# Altium project Mordovia_MCH_CLK.PrjPCB (part 2 of 2)

## Sheet PWR.SchDoc: Mordovia_MCH_CLK
size A4; Date: 2021; Author: Filip Świtakowski; DrawnBy: Filip Świtakowski; DocumentNumber: 4; Revision: 1.0; SheetNumber: 4; SheetTotal: 4; ModifiedBy: -; CheckedDate: -; Title2: PWR; DivGrp: WUT ISE; Designer: Filip Świtakowski
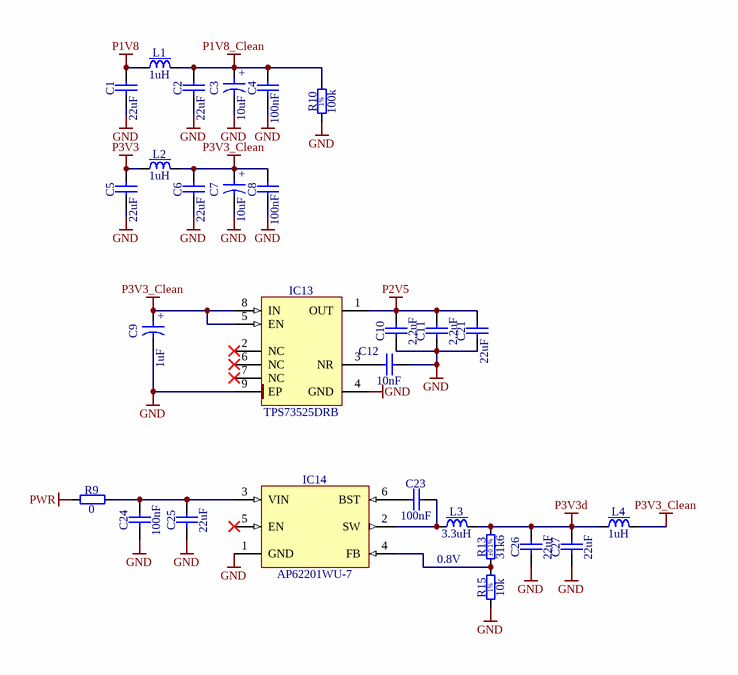
[diagram p4: PWR.SchDoc]

### Parts
C1  22uF  [CAPC2012X135N]
C2  22uF  [CAPC2012X135N]
C3  10uF  [CAPMP3216X180N]
C4  100nF  [CAPC1005X55N]
C5  22uF  [CAPC2012X135N]
C6  22uF  [CAPC2012X135N]
C7  10uF  [CAPMP3216X180N]
C8  100nF  [CAPC1005X55N]
C9  1uF  [CAPMP3216X180N]
C10  2.2uF  [CAPC1608X87N]
C11  2.2uF  [CAPC1608X87N]
C12  10nF  [CAPC1005X55N]
C21  22uF  [CAPC2012X135N]
C23  100nF  [CAPC1005X55N]
C24  100nF  [CAPC1005X55N]
C25  22uF  [CAPC2012X135N]
C26  22uF  [CAPC2012X135N]
C27  22uF  [CAPC2012X135N]
IC13  TPS73525DRB  [TEXAS_DRB(S-PVSON-N8)]
IC14  AP62201WU-7  [SOT95P280X100-6N]
L1  1uH  [IND_PANASONIC_ELLVGG]
L2  1uH  [IND_PANASONIC_ELLVGG]
L3  3.3uH  [IND_WURTH_WE-TPC_4828]
L4  1uH  [IND_PANASONIC_ELLVGG]
R9  0  [RESC1608X55N]
R10  100k  [RESC1005X40N]
R13  31k6  Tolerance: ±0.1%  [RESC1005X35N]
R15  10k  [RESC1005X40N]

### Nets
GND: C1.1 C2.1 C3.2 C4.1 C5.1 C6.1 C7.2 C8.1 C9.2 C10.1 C11.1 C12.2 C21.1 C24.1 C25.1 C26.1 C27.1 IC13.4(GND) IC13.9(EP) IC14.1(GND) R10.1 R15.1
P1V8: C1.2 L1.1
P1V8_Clean: C2.2 C3.1 C4.2 L1.2 R10.2
P2V5: C10.2 C11.2 C21.2 IC13.1(OUT)
P3V3: C5.2 L2.1
P3V3_Clean: C6.2 C7.1 C8.2 C9.1 IC13.5(EN) IC13.8(IN) L2.2 L4.2
P3V3d: C26.2 C27.2 L3.2 L4.1 R13.2
PWR: R9.1
NetC12_1: C12.1 IC13.3(NR)
NetC23_1: C23.1 IC14.6(BST)
NetC23_2: C23.2 IC14.2(SW) L3.1
NetC24_2: C24.2 C25.2 IC14.3(VIN) R9.2
NetIC14_4: IC14.4(FB) R13.1 R15.2

Not connected (* = marked no-connect by the designer): IC13 2(NC)* 6(NC)* 7(NC)*; IC14 5(EN)*

### Notes on the sheet
- 0.8V
- Project/Equipment
- Document
- Designer
- Drawn by
- Check.by
- 01.20201
- PW ISE
- Contact
- File
- Last Mod.
- Print Date
- Sheet
- Size
- A4
- of
- Rev
- Copyright WUT ISE 2021.
  This documentation describes Open Hardware and is licensed under the CERN OHL v.1.2. You may redistribute and modify this documentation under the terms of the CERN OHL v.1.2. (http://ohwr.org/CERNOHL). This documentation is distributed WITHOUT ANY EXPRESS OR IMPLIED WARRANTY, INCLUDING OF MERCHANTABILITY, SATISFACTORY QUALITY AND FITNESS FOR A PARTICULAR PURPOSE. Please see the CERN OHL v.1.2 for applicable conditions.
- Nowowiejska 15/19 00-665 Warsaw
- (in symbol CTE3216-18_1UF_16V_10%) +
- (in symbol CTE3216-18_10UF_16V_20%_AVX_TCJ) +
- (in symbol R0402_10K_1%_0.0625W_100PPM) 1%
- (in symbol R0402_100K_1%_0.0625W_100PPM) 1%

### Library data of the parts
C1 C2 C5 C6 C21 C25-C27 = CC0805_22UF_16V_10%_X5R: Non-polarised capacitor; Part Description: SMD Multilayer Chip Ceramic Capacitor; Manufacturer: GENERIC; Manufacturer1 Part Number: C2012X5R1C226KT; Voltage: 16V; TC: X5R; Tolerance: ±10%; Part Number: CC0805_22UF_16V_10%_X5R; Component Kind: Standard; Component Type: Standard; Pin Count: 2; Value: 22uF; Status: Preferred; Manufacturer Part Number: CC0805_22UF_16V_10%_X5R; Case: 0805; Mounted: Yes; Socket: No; SMD: Yes; Sense: No; Manufacturer1 Example: TDK; Manufacturer1 ComponentHeight: 1.35mm; HelpURL: \\cern.ch\dfs\Applications\Altium\Datasheets\CC0805_X5R_TDK_C.pdf; Author: CERN DEM JLC; CreateDate: 25.10.2012; LatestRevisionDate: 25.10.2012
C3 C7 = CTE3216-18_10UF_16V_20%_AVX_TCJ: Polarised capacitor; Part Description: ESR 0R200 Tantalum Solid Electrolytic Chip Capacitor with Conductive Polymer Electrode; Manufacturer: AVX; Manufacturer Part Number: TCJA106M016R0200; Voltage: 16V; Tolerance: ±20%; Part Number: CTE3216-18_10UF_16V_20%_AVX_TCJ; Component Kind: Standard; Component Type: Standard; Pin Count: 2; Value: 10uF; Status: Preferred; Case: A; Mounted: Yes; Socket: No; SMD: Yes; Sense: No; ComponentHeight: 1.8mm; HelpURL: \\cern.ch\dfs\Applications\Altium\Datasheets\CTE_AVX_TCJ.pdf; Author: CERN DEM JLC; CreateDate: 29.03.2012; LatestRevisionDate: 29.03.2012
C4 C8 = CC0402_100NF_50V_10%_X7R: Non-polarised capacitor; Part Description: SMD Multilayer Chip Ceramic Capacitor; Manufacturer: GENERIC; Manufacturer1 Part Number: GRM155R71H104KE14D; Voltage: 50V; TC: X7R; Tolerance: ±10%; Part Number: CC0402_100NF_50V_10%_X7R; Component Kind: Standard; Component Type: Standard; Pin Count: 2; Value: 100nF; Status: None; Manufacturer Part Number: CC0402_100NF_50V_10%_X7R; Case: 0402; Mounted: Yes; Socket: No; SMD: Yes; Sense: No; Manufacturer1 Example: MURATA; Manufacturer1 ComponentHeight: 0.55mm; HelpURL: \\cern.ch\dfs\Applications\Altium\Datasheets\CC0402_MURATA_GRM155R71H104KE14D.pdf; Author: CERN DEM MR; CreateDate: 30.06.2017; LatestRevisionDate: 30.06.2017
C9 = CTE3216-18_1UF_16V_10%: Polarised capacitor; Part Description: Solid Tantalum Chip Capacitor; Manufacturer: GENERIC; Manufacturer1 Part Number: TAJA105K016RNJ; Voltage: 16V; Tolerance: ±10%; Part Number: CTE3216-18_1UF_16V_10%; Component Kind: Standard; Component Type: Standard; Pin Count: 2; Value: 1uF; Status: Preferred; Manufacturer Part Number: CTE3216-18_1UF_16V_10%; Case: A; Mounted: Yes; Socket: No; SMD: Yes; Sense: No; Manufacturer1 Example: AVX; Manufacturer1 ComponentHeight: 1.8mm; HelpURL: \\cern.ch\dfs\Applications\Altium\Datasheets\CTE_AVX_TAJ.pdf; Author: CERN DEM JLC; CreateDate: 03.09.2012; LatestRevisionDate: 03.09.2012
C10 C11 = CC0603_2.2UF_16V_10%_X5R: Non-polarised capacitor; Part Description: SMD Multilayer Chip Ceramic Capacitor; Manufacturer: GENERIC; Manufacturer1 Part Number: CC0603KRX5R7BB225; Voltage: 16V; TC: X5R; Tolerance: ±10%; Part Number: CC0603_2.2UF_16V_10%_X5R; Component Kind: Standard; Component Type: Standard; Pin Count: 2; Value: 2.2uF; Status: Preferred; Manufacturer Part Number: CC0603_2.2UF_16V_10%_X5R; Case: 0603; Mounted: Yes; Socket: No; SMD: Yes; Sense: No; Manufacturer1 Example: YAGEO PHYCOMP; Manufacturer1 ComponentHeight: 0.9mm; HelpURL: \\cern.ch\dfs\Applications\Altium\Datasheets\CC0805_X5R_PHYCOMP_HC.pdf; Author: CERN DEM JLC; CreateDate: 28.04.2011; LatestRevisionDate: 28.04.2011
C12 = CC0402_10NF_16V_10%_X7R: Non-polarised capacitor; Part Description: SMD Multilayer Chip Ceramic Capacitor; Manufacturer: GENERIC; Manufacturer1 Part Number: 223878715636; Voltage: 16V; TC: X7R; Tolerance: ±10%; Part Number: CC0402_10NF_16V_10%_X7R; Component Kind: Standard; Component Type: Standard; Pin Count: 2; Value: 10nF; Status: Not Recommended; Manufacturer Part Number: CC0402_10NF_16V_10%_X7R; Case: 0402; Mounted: Yes; Socket: No; SMD: Yes; Sense: No; Manufacturer1 Example: PHYCOMP; Manufacturer1 ComponentHeight: 0.55mm; HelpURL: \\cern.ch\dfs\Applications\Altium\Datasheets\CC0402_X7R_PHYCOMP.pdf; Author: CERN DEM JLC; CreateDate: 03.12.2007; LatestRevisionDate: 03.12.2007
C23 C24 = CC0402_100NF_16V_10%_X5R: Non-polarised capacitor; Part Description: SMD Multilayer Chip Ceramic Capacitor; Manufacturer: GENERIC; Manufacturer1 Part Number: GRM155R61C104KA88D; Voltage: 16V; TC: X5R; Tolerance: ±10%; Part Number: CC0402_100NF_16V_10%_X5R; Component Kind: Standard; Component Type: Standard; Pin Count: 2; Value: 100nF; Status: None; Manufacturer Part Number: CC0402_100NF_16V_10%_X5R; Case: 0402; Mounted: Yes; Socket: No; SMD: Yes; Sense: No; Manufacturer1 Example: MURATA; Manufacturer1 ComponentHeight: 0.55mm; HelpURL: \\cern.ch\dfs\Applications\Altium\Datasheets\CC0402_X5R_MURATA_GRM.pdf; Author: CERN DEM JLC; CreateDate: 10.12.2013; LatestRevisionDate: 10.12.2013
IC13 = TPS73525DRB: 500mA, Low Quiescent Current, Low Noise, High PSRR, Low-Dropout Linear Regulator; Part Description: 2.5V, 500mA, Low Quiescent Current, Low Noise, High PSRR, Low-Dropout Linear Regulator; Manufacturer: TEXAS INSTRUMENTS; PressFit: No; Bonding: No; Part Number: TPS73525DRB; Component Kind: Standard; Component Type: Standard; Device: TPS73525DRB; PackageDescription: TEXAS Case Style DRB(S-PVSON-N8), SON, 0.65mm Pitch, 8 Pin, 3.00mm W X 3.00mm L X 1.00mm H body (w/Thermal Tab 1.60 X 1.85mm); Manufacturer Part Number: TPS73525DRB; Pin Count: 9; Case: SON8; Mounted: Yes; Socket: No; SMD: Yes; Sense: No; ComponentHeight: 1mm; HelpURL: \\cern.ch\dfs\Applications\Altium\Datasheets\TPS73525DRB.pdf; Author: CERN DEM BC; CreateDate: 18.02.2020; LatestRevisionDate: 18.02.2020
IC14 = AP62201WU-7: 4.2V TO 18V INPUT, 2A LOW IQ SYNCHRONOUS BUCK CONVERTER; Manufacturer: DIODES INCORPORATED; PressFit: No; Bonding: No; Part Number: AP62201WU-7; Component Kind: Standard; Component Type: Standard; Device: AP62201WU-7; PackageDescription: SOT23, 0.95mm Pitch; 6 Pin, 1.625mm W X 2.90mm L X 1.00mm H body, IPC Medium Density; Part Description: 4.2V To 18V Input, 2A Low Iq Synchronous Buck Converter; Manufacturer Part Number: AP62201WU; Pin Count: 6; Case: SOT23-6; Mounted: Yes; Socket: No; SMD: Yes; Sense: No; ComponentHeight: 1.1mm; HelpURL: \\cern.ch\dfs\Applications\Altium\Datasheets\AP6220x.pdf; Author: CERN DEM HF; CreateDate: 07.01.2022; LatestRevisionDate: 21.03.2022
L1 L2 L4 = IND_1UH_30%_PANASONIC_ELLVGG1R0N: Inductor With Core; Part Description: Wire Wound SMD Power Inductor, G Series, Type ELLVGG; Power: 1.8A; Resistance: 0.052R; Tolerance: ±30%; Part Number: IND_1UH_30%_PANASONIC_ELLVGG1R0N; Component Kind: Standard; Component Type: Standard; Pin Count: 2; Value: 1uH; Status: None; Manufacturer: PANASONIC; Manufacturer Part Number: ELLVGG1R0N; Mounted: Yes; Socket: No; SMD: Yes; Sense: No; ComponentHeight: 1.5mm; HelpURL: \\cern.ch\dfs\Applications\Altium\Datasheets\IND_PANASONIC_ELLVGG.pdf; Author: CERN DEM JLC; CreateDate: 09.11.2016; LatestRevisionDate: 09.11.2016
L3 = IND_3.3UH_30%_WURTH_WE-TPC_744043003: Inductor With Core; Part Description: Shielded Tiny Power Inductor (WE-TPC Serie); Manufacturer: WURTH ELEKTRONIK; Power: 2.15A; Resistance: 0.03R; Tolerance: ±30%; Part Number: IND_3.3UH_30%_WURTH_WE-TPC_744043003; Component Kind: Standard; Component Type: Standard; Pin Count: 2; Value: 3.3uH; Manufacturer Part Number: 744043003; Mounted: Yes; Socket: No; SMD: Yes; Sense: No; ComponentHeight: 3mm; HelpURL: \\cern.ch\dfs\Applications\Altium\Datasheets\IND_WURTH_WE-TPC_744043003.pdf; Author: CERN DEM JLC; CreateDate: 12.07.2011; LatestRevisionDate: 24.01.2012
R9 = R0603_0R_JUMPER: Resistor; Part Description: 1A (0.05R Max DC Resistance) Zero Ohm Jumper; Manufacturer: GENERIC; Manufacturer1 Part Number: NRC06Z0; PressFit: No; Part Number: R0603_0R_JUMPER; Component Kind: Standard; Component Type: Standard; Pin Count: 2; Value: 0; Status: Preferred; Manufacturer Part Number: R0603_0R_JUMPER; Case: 0603; Mounted: Yes; Sense: No; Socket: No; SMD: Yes; Manufacturer1 Example: NIC COMPONENT; Manufacturer1 ComponentHeight: 0.55mm; HelpURL: \\cern.ch\dfs\Applications\Altium\Datasheets\R0603_NIC_NRC.pdf; Author: CERN DEM JLC; CreateDate: 03.12.2007; LatestRevisionDate: 13.03.2008
R10 = R0402_100K_1%_0.0625W_100PPM: Resistor - 1%; Part Description: General Purpose Thick Film Chip Resistor; Manufacturer: GENERIC; Manufacturer1 Part Number: 232270671004L; TC: ±100ppm/°C; PressFit: No; Part Number: R0402_100K_1%_0.0625W_100PPM; Component Kind: Standard; Component Type: Standard; Pin Count: 2; Value: 100k; Status: Not Recommended; Power: 0.0625W; Tolerance: ±1%; Manufacturer Part Number: R0402_100K_1%_0.0625W_100PPM; Case: 0402; Mounted: Yes; Sense: No; Socket: No; SMD: Yes; Manufacturer1 Example: YAGEO PHYCOMP; Manufacturer1 ComponentHeight: 0.4mm; HelpURL: \\cern.ch\dfs\Applications\Altium\Datasheets\R0402_Phycomp_RC0402.pdf; Author: CERN DEM JLC; CreateDate: 12/3/2007; LatestRevisionDate: 10/17/2012
R13 = R0402_31K6_0.1%_0.063W_25PPM_YAGEO_RT: Resistor - 0.1%; Part Description: Thin Film Chip Resistor; Manufacturer: YAGEO; Manufacturer Part Number: RT0402BRD0731K6L; Power: 0.063W; TC: ±25ppm/°C; Voltage: 50V; PressFit: No; Part Number: R0402_31K6_0.1%_0.063W_25PPM_YAGEO_RT; Component Kind: Standard; Component Type: Standard; Pin Count: 2; Value: 31k6; Status: Not Recommended; Case: 0402; Mounted: Yes; Sense: No; Socket: No; SMD: Yes; ComponentHeight: 0.35mm; HelpURL: \\cern.ch\dfs\Applications\Altium\Datasheets\R0402_YAGEO_RT.pdf; Author: CERN DEM BC; CreateDate: 30.07.2020; LatestRevisionDate: 30.07.2020
R15 = R0402_10K_1%_0.0625W_100PPM: Resistor - 1%; Part Description: General Purpose Thick Film Chip Resistor; Manufacturer: GENERIC; Manufacturer1 Part Number: 232270671003L; TC: ±100ppm/°C; Part Number: R0402_10K_1%_0.0625W_100PPM; Component Kind: Standard; Component Type: Standard; Pin Count: 2; Value: 10k; Status: Not recommended; Power: 0.0625W; Tolerance: ±1%; Manufacturer Part Number: R0402_10K_1%_0.0625W_100PPM; Case: 0402; Mounted: Yes; Sense: No; Socket: No; SMD: Yes; Manufacturer1 Example: YAGEO PHYCOMP; Manufacturer1 ComponentHeight: 0.4mm; HelpURL: \\cern.ch\dfs\Applications\Altium\Datasheets\R0402_Phycomp_RC0402.pdf; Author: CERN DEM JLC; CreateDate: 03.12.2007; LatestRevisionDate: 17.10.2012

## Nets that join several sheets
GND: Mordovia_MCH_CLK (88 pins), 2 (15 pins), 3 (15 pins), M-LVDS PHY (65 pins), PWR (22 pins), 1 (15 pins)
P1V8: Mordovia_MCH_CLK (J1.40), PWR (C1.2 L1.1)
P1V8_Clean: Mordovia_MCH_CLK (TP2.1), M-LVDS PHY (19 pins), PWR (5 pins)
P2V5: Mordovia_MCH_CLK (R4.2 R5.2 TP4.1), 2 (14 pins), 3 (14 pins), PWR (C10.2 C11.2 C21.2 IC13.1), 1 (14 pins)
P3V3: Mordovia_MCH_CLK (J1.35 J1.36 J1.37), PWR (C5.2 L2.1)
P3V3_Clean: Mordovia_MCH_CLK (R2.2 TP1.1), M-LVDS PHY (48 pins), PWR (8 pins)
PWR: Mordovia_MCH_CLK (8 pins), PWR (R9.1)
CLK1-2_N: Mordovia_MCH_CLK (J4.54), 1 (IC1_1.15)
CLK1-2_P: Mordovia_MCH_CLK (J4.53), 1 (IC1_1.14)
CLK1-3_N: Mordovia_MCH_CLK (J4.57), 1 (IC1_1.17)
CLK1-3_P: Mordovia_MCH_CLK (J4.56), 1 (IC1_1.16)
CLK1-4_N: Mordovia_MCH_CLK (J4.60), 1 (IC1_1.19)
CLK1-4_P: Mordovia_MCH_CLK (J4.59), 1 (IC1_1.18)
CLK1-5_N: Mordovia_MCH_CLK (J4.63), 1 (IC1_1.23)
CLK1-5_P: Mordovia_MCH_CLK (J4.62), 1 (IC1_1.22)
CLK1-6_N: Mordovia_MCH_CLK (J4.66), 1 (IC1_1.25)
CLK1-6_P: Mordovia_MCH_CLK (J4.65), 1 (IC1_1.24)
CLK1-7_N: Mordovia_MCH_CLK (J4.69), 1 (IC1_1.27)
CLK1-7_P: Mordovia_MCH_CLK (J4.68), 1 (IC1_1.26)
CLK1-8_N: Mordovia_MCH_CLK (J4.72), 1 (IC1_1.29)
CLK1-8_P: Mordovia_MCH_CLK (J4.71), 1 (IC1_1.28)
CLK1-9_N: Mordovia_MCH_CLK (J4.75), 1 (IC1_1.33)
CLK1-9_P: Mordovia_MCH_CLK (J4.74), 1 (IC1_1.32)
CLK1-10_N: Mordovia_MCH_CLK (J4.78), 1 (IC1_1.35)
CLK1-10_P: Mordovia_MCH_CLK (J4.77), 1 (IC1_1.34)
CLK1-11_N: Mordovia_MCH_CLK (J4.81), 1 (IC1_1.37)
CLK1-11_P: Mordovia_MCH_CLK (J4.80), 1 (IC1_1.36)
CLK1-12_N: Mordovia_MCH_CLK (J4.84), 1 (IC1_1.39)
CLK1-12_P: Mordovia_MCH_CLK (J4.83), 1 (IC1_1.38)
CLK1_IN_N: Mordovia_MCH_CLK (R16.1 R21.2), 1 (IC1_1.8 R32_1.2 R35_1.1)
CLK1_IN_P: Mordovia_MCH_CLK (R11.1 R19.2), 1 (IC1_1.9 R32_1.1 R34_1.1)
CLK1_OUT_N: Mordovia_MCH_CLK (R20.1), 1 (IC1_1.13)
CLK1_OUT_P: Mordovia_MCH_CLK (R18.1), 1 (IC1_1.12)
CLK2-2_N: Mordovia_MCH_CLK (J4.117), 2 (IC1_2.15)
CLK2-2_P: Mordovia_MCH_CLK (J4.118), 2 (IC1_2.14)
CLK2-3_N: Mordovia_MCH_CLK (J4.114), 2 (IC1_2.17)
CLK2-3_P: Mordovia_MCH_CLK (J4.115), 2 (IC1_2.16)
CLK2-4_N: Mordovia_MCH_CLK (J4.111), 2 (IC1_2.19)
CLK2-4_P: Mordovia_MCH_CLK (J4.112), 2 (IC1_2.18)
CLK2-5_N: Mordovia_MCH_CLK (J4.108), 2 (IC1_2.23)
CLK2-5_P: Mordovia_MCH_CLK (J4.109), 2 (IC1_2.22)
CLK2-6_N: Mordovia_MCH_CLK (J4.105), 2 (IC1_2.25)
CLK2-6_P: Mordovia_MCH_CLK (J4.106), 2 (IC1_2.24)
CLK2-7_N: Mordovia_MCH_CLK (J4.102), 2 (IC1_2.27)
CLK2-7_P: Mordovia_MCH_CLK (J4.103), 2 (IC1_2.26)
CLK2-8_N: Mordovia_MCH_CLK (J4.99), 2 (IC1_2.29)
CLK2-8_P: Mordovia_MCH_CLK (J4.100), 2 (IC1_2.28)
CLK2-9_N: Mordovia_MCH_CLK (J4.96), 2 (IC1_2.33)
CLK2-9_P: Mordovia_MCH_CLK (J4.97), 2 (IC1_2.32)
CLK2-10_N: Mordovia_MCH_CLK (J4.93), 2 (IC1_2.35)
CLK2-10_P: Mordovia_MCH_CLK (J4.94), 2 (IC1_2.34)
CLK2-11_N: Mordovia_MCH_CLK (J4.90), 2 (IC1_2.37)
CLK2-11_P: Mordovia_MCH_CLK (J4.91), 2 (IC1_2.36)
CLK2-12_N: Mordovia_MCH_CLK (J4.87), 2 (IC1_2.39)
CLK2-12_P: Mordovia_MCH_CLK (J4.88), 2 (IC1_2.38)
CLK2_IN_N: Mordovia_MCH_CLK (R24.1 R29.2), 2 (IC1_2.8 R32_2.2 R35_2.1)
CLK2_IN_P: Mordovia_MCH_CLK (R22.1 R27.2), 2 (IC1_2.9 R32_2.1 R34_2.1)
CLK2_OUT_N: Mordovia_MCH_CLK (R28.1), 2 (IC1_2.13)
CLK2_OUT_P: Mordovia_MCH_CLK (R26.1), 2 (IC1_2.12)
CLK3-2_N: Mordovia_MCH_CLK (J4.36), 3 (IC1_3.15)
CLK3-2_P: Mordovia_MCH_CLK (J4.35), 3 (IC1_3.14)
CLK3-3_N: Mordovia_MCH_CLK (J4.39), 3 (IC1_3.17)
CLK3-3_P: Mordovia_MCH_CLK (J4.38), 3 (IC1_3.16)
CLK3-4_N: Mordovia_MCH_CLK (J4.42), 3 (IC1_3.19)
CLK3-4_P: Mordovia_MCH_CLK (J4.41), 3 (IC1_3.18)
CLK3-5_N: Mordovia_MCH_CLK (J4.45), 3 (IC1_3.23)
CLK3-5_P: Mordovia_MCH_CLK (J4.44), 3 (IC1_3.22)
CLK3-6_N: Mordovia_MCH_CLK (J4.48), 3 (IC1_3.25)
CLK3-6_P: Mordovia_MCH_CLK (J4.47), 3 (IC1_3.24)
CLK3-7_N: Mordovia_MCH_CLK (J4.138), 3 (IC1_3.27)
CLK3-7_P: Mordovia_MCH_CLK (J4.139), 3 (IC1_3.26)
CLK3-8_N: Mordovia_MCH_CLK (J4.135), 3 (IC1_3.29)
CLK3-8_P: Mordovia_MCH_CLK (J4.136), 3 (IC1_3.28)
CLK3-9_N: Mordovia_MCH_CLK (J4.132), 3 (IC1_3.33)
CLK3-9_P: Mordovia_MCH_CLK (J4.133), 3 (IC1_3.32)
CLK3-10_N: Mordovia_MCH_CLK (J4.129), 3 (IC1_3.35)
CLK3-10_P: Mordovia_MCH_CLK (J4.130), 3 (IC1_3.34)
CLK3-11_N: Mordovia_MCH_CLK (J4.126), 3 (IC1_3.37)
CLK3-11_P: Mordovia_MCH_CLK (J4.127), 3 (IC1_3.36)
CLK3-12_N: Mordovia_MCH_CLK (J4.123), 3 (IC1_3.39)
CLK3-12_P: Mordovia_MCH_CLK (J4.124), 3 (IC1_3.38)
CLK3_IN_N: Mordovia_MCH_CLK (R37.1 R42.2), 3 (IC1_3.8 R32_3.2 R35_3.1)
CLK3_IN_P: Mordovia_MCH_CLK (R33.1 R40.2), 3 (IC1_3.9 R32_3.1 R34_3.1)
CLK3_OUT_N: Mordovia_MCH_CLK (R41.1), 3 (IC1_3.13)
CLK3_OUT_P: Mordovia_MCH_CLK (R39.1), 3 (IC1_3.12)
LA21_N: Mordovia_MCH_CLK (J1.32), M-LVDS PHY (IC12.3)
LA21_P: Mordovia_MCH_CLK (J1.33), M-LVDS PHY (IC2.5 IC12.5)
LA24_N: Mordovia_MCH_CLK (J1.23), M-LVDS PHY (IC8.3)
LA24_P: Mordovia_MCH_CLK (J1.24), M-LVDS PHY (IC2.4 IC8.5)
LA25_N: Mordovia_MCH_CLK (J1.26), M-LVDS PHY (IC9.3)
LA25_P: Mordovia_MCH_CLK (J1.27), M-LVDS PHY (IC2.3 IC9.5)
LA26_N: Mordovia_MCH_CLK (J1.29), M-LVDS PHY (IC11.3)
LA26_P: Mordovia_MCH_CLK (J1.30), M-LVDS PHY (IC2.6 IC11.5)
LA28_N: Mordovia_MCH_CLK (J1.17), M-LVDS PHY (IC6.3)
LA28_P: Mordovia_MCH_CLK (J1.18), M-LVDS PHY (IC2.10 IC6.5)
LA29_N: Mordovia_MCH_CLK (J1.20), M-LVDS PHY (IC7.3)
LA29_P: Mordovia_MCH_CLK (J1.21), M-LVDS PHY (IC2.9 IC7.5)
LA30_N: Mordovia_MCH_CLK (J1.11), M-LVDS PHY (IC3.3)
LA30_P: Mordovia_MCH_CLK (J1.12), M-LVDS PHY (IC2.8 IC3.5)
LA31_N: Mordovia_MCH_CLK (J1.14), M-LVDS PHY (IC4.3)
LA31_P: Mordovia_MCH_CLK (J1.15), M-LVDS PHY (IC2.7 IC4.5)
MLVDS_AMC.MLVDS1_N: Mordovia_MCH_CLK (J4.12), M-LVDS PHY (IC5.48)
MLVDS_AMC.MLVDS1_P: Mordovia_MCH_CLK (J4.11), M-LVDS PHY (IC5.47)
MLVDS_AMC.MLVDS2_N: Mordovia_MCH_CLK (J4.159), M-LVDS PHY (IC5.4)
MLVDS_AMC.MLVDS2_P: Mordovia_MCH_CLK (J4.160), M-LVDS PHY (IC5.3)
MLVDS_AMC.MLVDS3_N: Mordovia_MCH_CLK (J4.9), M-LVDS PHY (IC5.10)
MLVDS_AMC.MLVDS3_P: Mordovia_MCH_CLK (J4.8), M-LVDS PHY (IC5.9)
MLVDS_AMC.MLVDS4_N: Mordovia_MCH_CLK (J4.162), M-LVDS PHY (IC5.14)
MLVDS_AMC.MLVDS4_P: Mordovia_MCH_CLK (J4.163), M-LVDS PHY (IC5.13)
MLVDS_AMC.MLVDS5_N: Mordovia_MCH_CLK (J4.3), M-LVDS PHY (IC10.48)
MLVDS_AMC.MLVDS5_P: Mordovia_MCH_CLK (J4.2), M-LVDS PHY (IC10.47)
MLVDS_AMC.MLVDS6_N: Mordovia_MCH_CLK (J4.168), M-LVDS PHY (IC10.4)
MLVDS_AMC.MLVDS6_P: Mordovia_MCH_CLK (J4.169), M-LVDS PHY (IC10.3)
MLVDS_AMC.MLVDS7_N: Mordovia_MCH_CLK (J4.6), M-LVDS PHY (IC10.10)
MLVDS_AMC.MLVDS7_P: Mordovia_MCH_CLK (J4.5), M-LVDS PHY (IC10.9)
MLVDS_AMC.MLVDS8_N: Mordovia_MCH_CLK (J4.165), M-LVDS PHY (IC10.14)
MLVDS_AMC.MLVDS8_P: Mordovia_MCH_CLK (J4.166), M-LVDS PHY (IC10.13)

## Assembly variants
Default: not fitted R1_1 R1_1 R1_2 R1_3 R6_1 R6_1 R6_2 R6_3 R18 R18 R19 R19 R20 R20 R21 R21 R26 R26 R27 R27 R27_1 R27_2 R27_3 R28 R28 R28_1 R28_2 R28_3 R29 R29 R29_1 R29_2 R29_3 R33_1 R33_2 R33_3 R34_1 R34_1 R34_2 R34_3 R35_1 R35_1 R35_2 R35_3 R39 R39 R40 R40 R41 R41 R42 R42